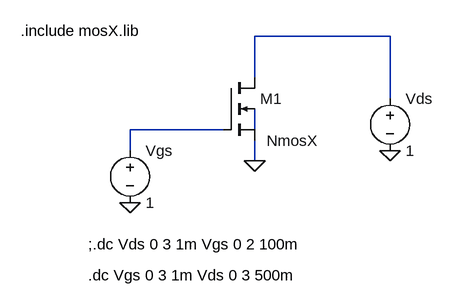
[diagram p0: schematic mosfetcurves.asc]
mosfetcurves.asc, the LTspice schematic file:
Version 4
SHEET 1 1848 680
WIRE 608 32 400 32
WIRE 400 96 400 32
WIRE 608 128 608 32
WIRE 352 176 208 176
WIRE 400 176 400 144
WIRE 208 208 208 176
WIRE 400 224 400 192
FLAG 208 288 0
FLAG 400 224 0
FLAG 608 208 0
SYMBOL nmos4 352 96 R0
WINDOW 3 66 97 Left 2
SYMATTR Value NmosX
SYMATTR InstName M1
SYMBOL voltage 608 112 R0
WINDOW 123 0 0 Left 0
WINDOW 39 0 0 Left 0
SYMATTR InstName Vds
SYMATTR Value 1
SYMBOL voltage 208 192 R0
WINDOW 123 0 0 Left 0
WINDOW 39 0 0 Left 0
SYMATTR InstName Vgs
SYMATTR Value 1
TEXT 40 24 Left 2 !.include mosX.lib
TEXT 144 352 Left 2 !;.dc Vds 0 3 1m Vgs 0 2 100m
TEXT 144 400 Left 2 !.dc Vgs 0 3 1m Vds 0 3 500m

The netlist it stands for:
* mosfetcurves.asc
M1 N001 N002 0 N003 NmosX
Vds N001 0 1
Vgs N002 0 1
.model NMOS NMOS
.model PMOS PMOS
.lib standard.mos
.include mosX.lib
;.dc Vds 0 3 1m Vgs 0 2 100m
.dc Vgs 0 3 1m Vds 0 3 500m
.backanno
.end